# EAGLE design standard_jig (EAGLE 9.1.1)
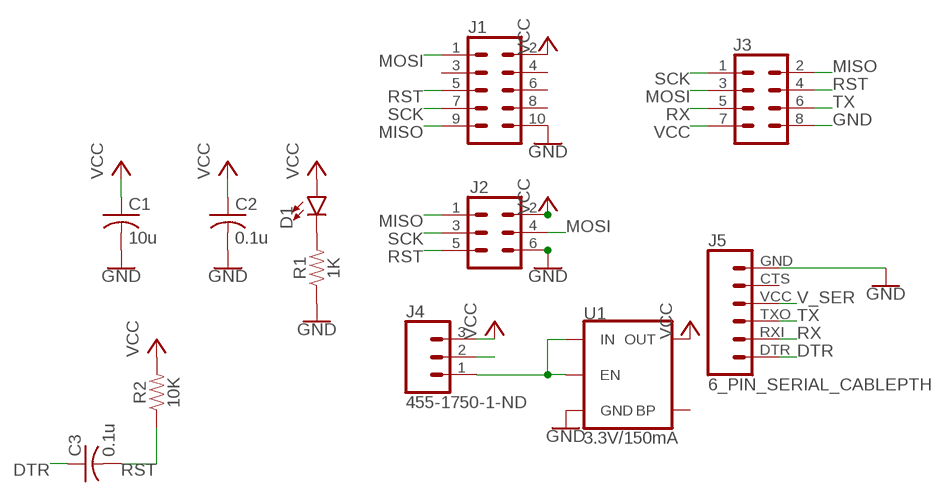
[diagram p0: schematic, sheet 1]

## Parts
C1  10u  C-USC1206  [C1206]
C2  0.1u  C-USC1206  [C1206]
C3  0.1u  C-USC1206  [C1206]
D1  LED1206  [LED-1206]
J1  CONN_05X2SHD  [2X5-SHROUDED]
J2  CONN_03X2SHROUD  [2X3-SHROUDED]
J3  CONN_04X2  [2X4]
J4  455-1750-1-ND  CONN_03  [1X03]
J5  6_PIN_SERIAL_CABLEPTH  [FTDI_BASIC]
R1  1K  RESISTOR1206  [1206]
R2  10K  RESISTOR1206  [1206]
U1  3.3V/150mA  V_REG_MIC52053.3V  [SOT23-5]

## Nets
DTR: C3.1 J5.DTR
GND: C1.2 C2.2 J1.10 J2.6 J3.8 J5.GND R1.1 U1.2(GND)
MISO: J1.9 J2.1 J3.2
MOSI: J1.1 J2.4 J3.3
N$1: D1.C R1.2
N$2: J4.2
N$7: J4.1 U1.1(IN) U1.3(EN)
RST: C3.2 J1.5 J2.5 J3.4 R2.1
RX: J3.5 J5.RXI
SCK: J1.7 J2.3 J3.1
TX: J3.6 J5.TXO
V_SER: J5.VCC
VCC: C1.1 C2.1 D1.A J1.2 J2.2 J3.7 J4.3 R2.2 U1.5(OUT)
Unconnected: J1.3 J1.4 J1.6 J1.8 J5.CTS U1.4(BP)

## Library data of the parts
C1-C3 = adafruit:C-US: CAPACITOR, American symbol
D1 = SparkFun-LED:LED: LED (Generic) Standard schematic elements and footprints for 5mm, 3mm, 1206, and 0603 sized LEDs. Generic LEDs with no color specified.
J1 = SparkFun-Connectors:CONN_05X2: Multi connection point. Often used as Generic Header-pin footprint for 0.1 inch spaced/style header connections For AVR SPI programming port, see special device with nice symbol: "AVR_SPI_PROG_5x2.dev" You can populate with any combo of single row headers, but if you'd like an exact match, check these: 2x5 AVR ICSP Male Header <https://www.sparkfun.com/products/778> (PRT-00778) 2x5 Pin Shrouded Header <https://www.sparkfun.com/products/8506> (PRT-08506) On any of the 0.1 inch spaced packages, you can populate with these: Break Away Headers - Straight <https://www.sparkfun.com/products/116> (PRT-00116) Break Away Male Headers - Right Angle <https://www.sparkfun.com/products/553> (PRT-00553) Female Headers <https://www.sparkfun.com/products/115> (PRT-00115) Break Away Headers - Machine Pin <https://www.sparkfun.com/products/117> (PRT-00117) Break Away Female Headers - Swiss Machine Pin <https://www.sparkfun.com/products/743> (PRT-00743) Special note: the shrouded connector mates well with our 5x2 ribbon cables: 2x5 Pin IDC Ribbon Cable <https://www.sparkfun.com/products/8535> (PRT-08535); PROD_ID: CONN-08671; SF_ID: PRT-08506
J2 = SparkFun-Connectors:CONN_03X2: Multi connection point. Often used as Generic Header-pin footprint for 0.1 inch spaced/style header connections You can populate with any combo of single row headers, but if you'd like an exact match, check these: Header - 2x3 (Male, 0.1") <https://www.sparkfun.com/products/12807> (PRT-12807) Header - 2x3 (Female, 0.1") <https://www.sparkfun.com/products/13010> (PRT-13010) 2x3 Pin Shrouded Header <https://www.sparkfun.com/products/10877> (PRT-10877) On any of the 0.1 inch spaced packages, you can populate with these: Break Away Headers - Straight <https://www.sparkfun.com/products/116> (PRT-00116) Break Away Male Headers - Right Angle <https://www.sparkfun.com/products/553> (PRT-00553) Female Headers <https://www.sparkfun.com/products/115> (PRT-00115) Break Away Headers - Machine Pin <https://www.sparkfun.com/products/117> (PRT-00117) Break Away Female Headers - Swiss Machine Pin <https://www.sparkfun.com/products/743> (PRT-00743) Special note: the shrouded connector mates well with our 3x2 ribbon cables: Ribbon Crimp Connector - 6-pin (2x3, Female) <https://www.sparkfun.com/products/10651> (PRT-10651) Ribbon Cable - 6 wire (15ft) <https://www.sparkfun.com/products/10646> (PRT-10646); PROD_ID: CONN-10681; SF_ID: PRT_10877
J3 = SparkFun-Connectors:CONN_04X2: Multi connection point. Often used as Generic Header-pin footprint for 0.1 inch spaced/style header connections On any of the 0.1 inch spaced packages, you can populate with these: Break Away Headers - Straight <https://www.sparkfun.com/products/116> (PRT-00116) Break Away Male Headers - Right Angle <https://www.sparkfun.com/products/553> (PRT-00553) Female Headers <https://www.sparkfun.com/products/115> (PRT-00115) Break Away Headers - Machine Pin <https://www.sparkfun.com/products/117> (PRT-00117) Break Away Female Headers - Swiss Machine Pin <https://www.sparkfun.com/products/743> (PRT-00743)
J4 = SparkFun-Connectors:CONN_03: Multi connection point. Often used as Generic Header-pin footprint for 0.1 inch spaced/style header connections On any of the 0.1 inch spaced packages, you can populate with these: Break Away Headers - Straight <https://www.sparkfun.com/products/116> (PRT-00116) Break Away Male Headers - Right Angle <https://www.sparkfun.com/products/553> (PRT-00553) Female Headers <https://www.sparkfun.com/products/115> (PRT-00115) Break Away Headers - Machine Pin <https://www.sparkfun.com/products/117> (PRT-00117) Break Away Female Headers - Swiss Machine Pin <https://www.sparkfun.com/products/743> (PRT-00743) Stackable Header - 3 Pin (Female, 0.1") <https://www.sparkfun.com/products/13875> (PRT-13875) For SCREWTERMINALS and SPRING TERMINALS visit here: Screw Terimnals on SparkFun.com <https://www.sparkfun.com/search/results?term=Screw+Terminals> (5mm/3.5mm/2.54mm spacing) This device is also useful as a general connection point to wire up your design to another part of your project. Our various solder wires solder well into these plated through hole pads. Hook-Up Wire - Assortment (Stranded, 22 AWG) <https://www.sparkfun.com/products/11375> (PRT-11375) Hook-Up Wire - Assortment (Solid Core, 22 AWG) <https://www.sparkfun.com/products/11367> (PRT-11367) View the entire wire category on our website here <https://www.sparkfun.com/categories/141> Special notes: Molex polarized connector foot print use with SKU : PRT-08232 with associated crimp pins and housings.; PROD_ID: XXX-00000
J5 = SparkFun-Connectors:6_PIN_SERIAL_CABLE: 6-pin header connection for use with the "FTDI BASIC" pinout - CABLE SIDE. Also known as "Arduino Serial Program Header". This is used on a design to provide a 6-pin connection point for serial communication usually from a USB cable (D+/D-) to these headers (RX/TX). It also has the remaining pins necessary for programming in the Arduino evironment (DTR, GND, and sometimes VCC). Note, this device has "CABLE" in the name. It is intended to be used on a design that usually lives on the end of your USB cable and prvides the converter chip (FTDI232 or FTDI231x) to commnicate serial RX/TX. The "sister" device, named "TARGET" is inteneded to be used on a design that contains a target micro-controller that you wish to program. You can populate with some of these: Female Headers <https://www.sparkfun.com/products/115> (PRT-00115) For reference (or to suit your programming needs) check out these designs: SparkFun FTDI Basic Breakout - 5V <https://www.sparkfun.com/products/9716> (DEV-09716) SparkFun FTDI Basic Breakout - 3.3V <https://www.sparkfun.com/products/9873> (DEV-09873) SparkFun FTDI SmartBasic <https://www.sparkfun.com/products/12935> (DEV-12935) SparkFun Beefy 3 - FTDI Basic Breakout <https://www.sparkfun.com/products/13746> (DEV-13746)
R1 R2 = SparkFun-Resistors:RESISTOR: Generic Resistor Package
U1 = SparkFun-IC-Power:V_REG_MIC5205: V_REG MIC5205 Standard 3.3V, 5V, and Adjustable 150mA LDO voltage regulator in SOT-23 layout. Micrel part MIC5205. BP (by-pass) pin is used to lower output noise with 470pF cap, may be left open. On the adjustable version BP is used to set output.; PROD_ID: VREG-00822

## Board
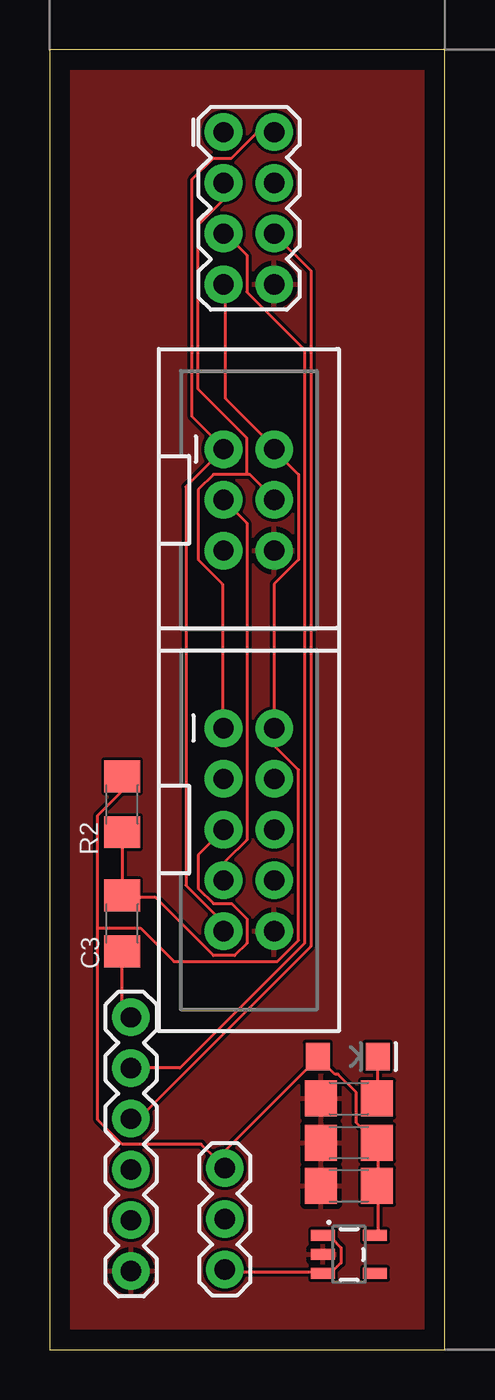
[diagram p1: board, top side]
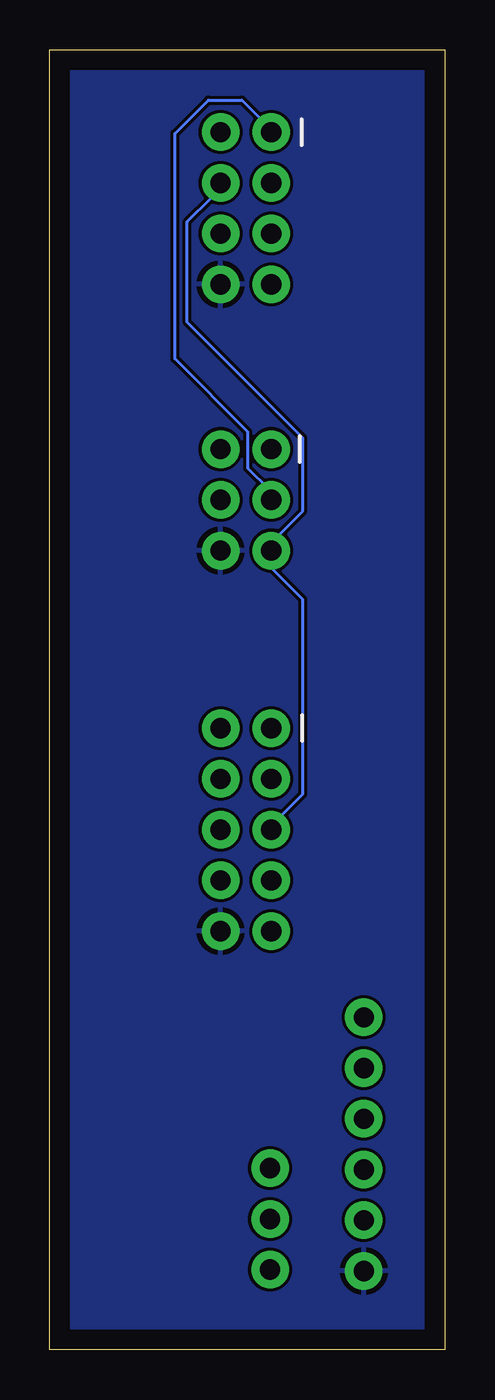
[diagram p2: board, bottom side, seen from below]

Size 19.79 x 65.08 mm. Coordinates in mm from the lower left corner, seen from the top.
Outline: 0,0 19.79,0 19.79,65.08 0,65.08 0,0
Copper layers (1*16): Top 0.035mm / dielectric 1.5mm / Bottom 0.035mm
Design rules "default": minimum track width 6mil, minimum drill 0.35mm, track to track 6mil, track to pad 6mil, pad to pad 6mil, via to via 6mil, smd to smd 6mil, copper to edge 40mil, drill to drill 6mil, minimum pad ring 10mil, minimum via ring 8mil, stop-mask expansion 4mil, vias tented up to drill 0mil, thermal gap 10mil

### Footprints (pad centres in the part's own frame; a part is rotated, then mirrored left to right if it is on the bottom)
C1206 = smd 1.6 x 1.8: 1 -1.4,0; 2 1.4,0
LED-1206 = smd 1.2 x 1.4: A -1.5,0; C 1.5,0
2X5-SHROUDED = drill 1.016 pad 1.88: 1 -1.27,5.08; 2 1.27,5.08; 3 -1.27,2.54; 4 1.27,2.54; 5 -1.27,0; 6 1.27,0; 7 -1.27,-2.54; 8 1.27,-2.54; 9 -1.27,-5.08; 10 1.27,-5.08
2X3-SHROUDED = drill 1.016 pad 1.88: 1 -1.27,2.54; 2 1.27,2.54; 3 -1.27,0; 4 1.27,0; 5 -1.27,-2.54; 6 1.27,-2.54
2X4 = drill 1.016 pad 1.88: 1 -3.81,-1.27; 2 -3.81,1.27; 3 -1.27,-1.27; 4 -1.27,1.27; 5 1.27,-1.27; 6 1.27,1.27; 7 3.81,-1.27; 8 3.81,1.27
1X03 = drill 1.016 pad 1.88: 1 0,0; 2 2.54,0; 3 5.08,0
FTDI_BASIC = drill 1.016 pad 1.88: CTS 10.16,0; DTR 0,0; GND 12.7,0; RXI 2.54,0; TXO 5.08,0; VCC 7.62,0
1206 = smd 1.6 x 1.8: 1 -1.4,0; 2 1.4,0
SOT23-5 = smd 0.55 x 1.2: 1 -0.95,-1.3; 2 0,-1.3; 3 0.95,-1.3; 4 0.95,1.3; 5 -0.95,1.3

### Placement (x,y rotation side)
C1  14.99,8.19 180 top
C2  14.99,10.35 180 top
C3  3.62,21.34 90 top
D1  14.92,14.67 0 top
J1  9.97,26.04 0 top
J2  9.97,42.55 0 top
J3  9.97,57.15 270 top
J4  8.76,4 90 top
J5  4.06,16.64 270 top
R1  14.99,12.57 0 top
R2  3.62,27.31 90 top
U1  14.99,4.76 270 top

### Tracks (layer width: path | path; a pad name or v marks a point on that pad's centre or on a via)
DTR
  Top 0.152: C3.1 3.62,16.99 3.92,16.69 J5.DTR
GND
  pour Top: -1.9,66.93 -1.9,-2.35 -1.59,-2.67 21.34,-2.67 21.59,-2.41 21.59,66.48 21.21,66.87 -1.71,66.87 -1.84,66.74
  pour Bottom: -4.25,68.96 -4.25,-4.38 25.02,-4.38 25.27,-4.64 25.27,67.44 23.43,69.28
MISO
  Top 0.152: J1.9 8.65,20.96 8.65,21.41 6.82,23.24 6.82,43.2 J2.1 8.65,45.19 7.12,46.71 7.12,58.6 8.19,59.67 9.11,59.67 10.33,60.88 11.24,60.88 J3.2
MOSI
  Top 0.152: 9.87,43.81 10.02,43.81 11.24,42.6 J2.4 | 9.87,43.81 8.19,43.81 7.43,43.05 7.43,39.55 8.65,38.33 8.65,31.17 J1.1 | 9.87,43.81 9.87,45.64 7.43,48.08 7.43,56.31 8.65,57.53 8.65,58.29 J3.3
N$1
  Top 0.152: D1.C 16.42,14.55 16.42,12.57 R1.2
N$7
  Top 0.152: U1.1 13.83,5.56 14.14,5.56 14.59,5.11 14.59,4.34 14.14,3.89 13.83,3.89 U1.3 13.68,3.89 8.8,3.89 J4.1
RST
  Top 0.152: R2.1 C3.2 3.62,22.63 5.3,22.63 8.19,19.74 9.26,19.74 9.87,20.35 9.87,21.57 9.11,22.33 8.19,22.33 7.43,23.09 7.43,24.76 J1.5
  Bottom 0.152: 8.65,40 8.65,39.09 7.12,37.57 7.12,27.81 8.8,26.14 J1.5 | 8.65,40 8.65,40.46 7.12,41.99 7.12,45.64 12.92,51.44 12.92,56.46 11.7,57.68 11.7,57.84 11.24,58.29 J3.4 | 8.65,40 J2.5
RX
  Top 0.152: J5.RXI 6.52,14.1 12.76,20.35 12.76,50.06 9.87,52.96 9.87,54.79 8.8,55.86 J3.5
SCK
  Top 0.152: J2.3 9.87,41.38 9.87,25.53 8.8,24.46 8.8,23.55 J1.7
  Bottom 0.152: J3.1 8.8,61.04 9.26,61.49 9.26,61.65 10.17,62.56 11.85,62.56 13.53,60.88 13.53,49.61 9.87,45.95 9.87,44.12 8.8,43.05 8.8,42.6 J2.3
TX
  Top 0.152: J5.TXO 4.08,11.66 4.53,11.66 13.07,20.19 13.07,54.03 11.24,55.86 J3.6
VCC
  Top 0.152: J3.7 8.8,53.26 8.8,47.62 11.24,45.19 J2.2 11.24,45.03 12.46,43.81 12.46,39.55 11.24,38.33 J1.2 11.24,30.25 12.46,29.03 12.46,20.5 11.39,19.43 6.21,19.43 4.53,21.11 2.4,21.11 | U1.5 16.42,5.71 16.42,8.15 C1.1 16.42,8.31 16.42,10.29 C2.1 16.27,10.44 15.35,11.35 15.35,12.88 14.44,13.79 14.29,13.79 13.53,14.55 D1.A 13.37,14.55 8.34,9.53 | R2.2 3.62,27.96 2.4,26.75 2.4,21.11 | 2.4,21.11 2.4,11.51 3.62,10.29 7.58,10.29 8.34,9.53 | 8.34,9.53 8.65,9.22 J4.3 8.34,9.53

### Text on the board
bValues: (c) Jimmy He, Sunmola Orealuwa / University of Illinois at Urbana-Champaign | WaggleNet Pogo Jig | Version 1.0